# Altium project PCB_Project.PrjPcb
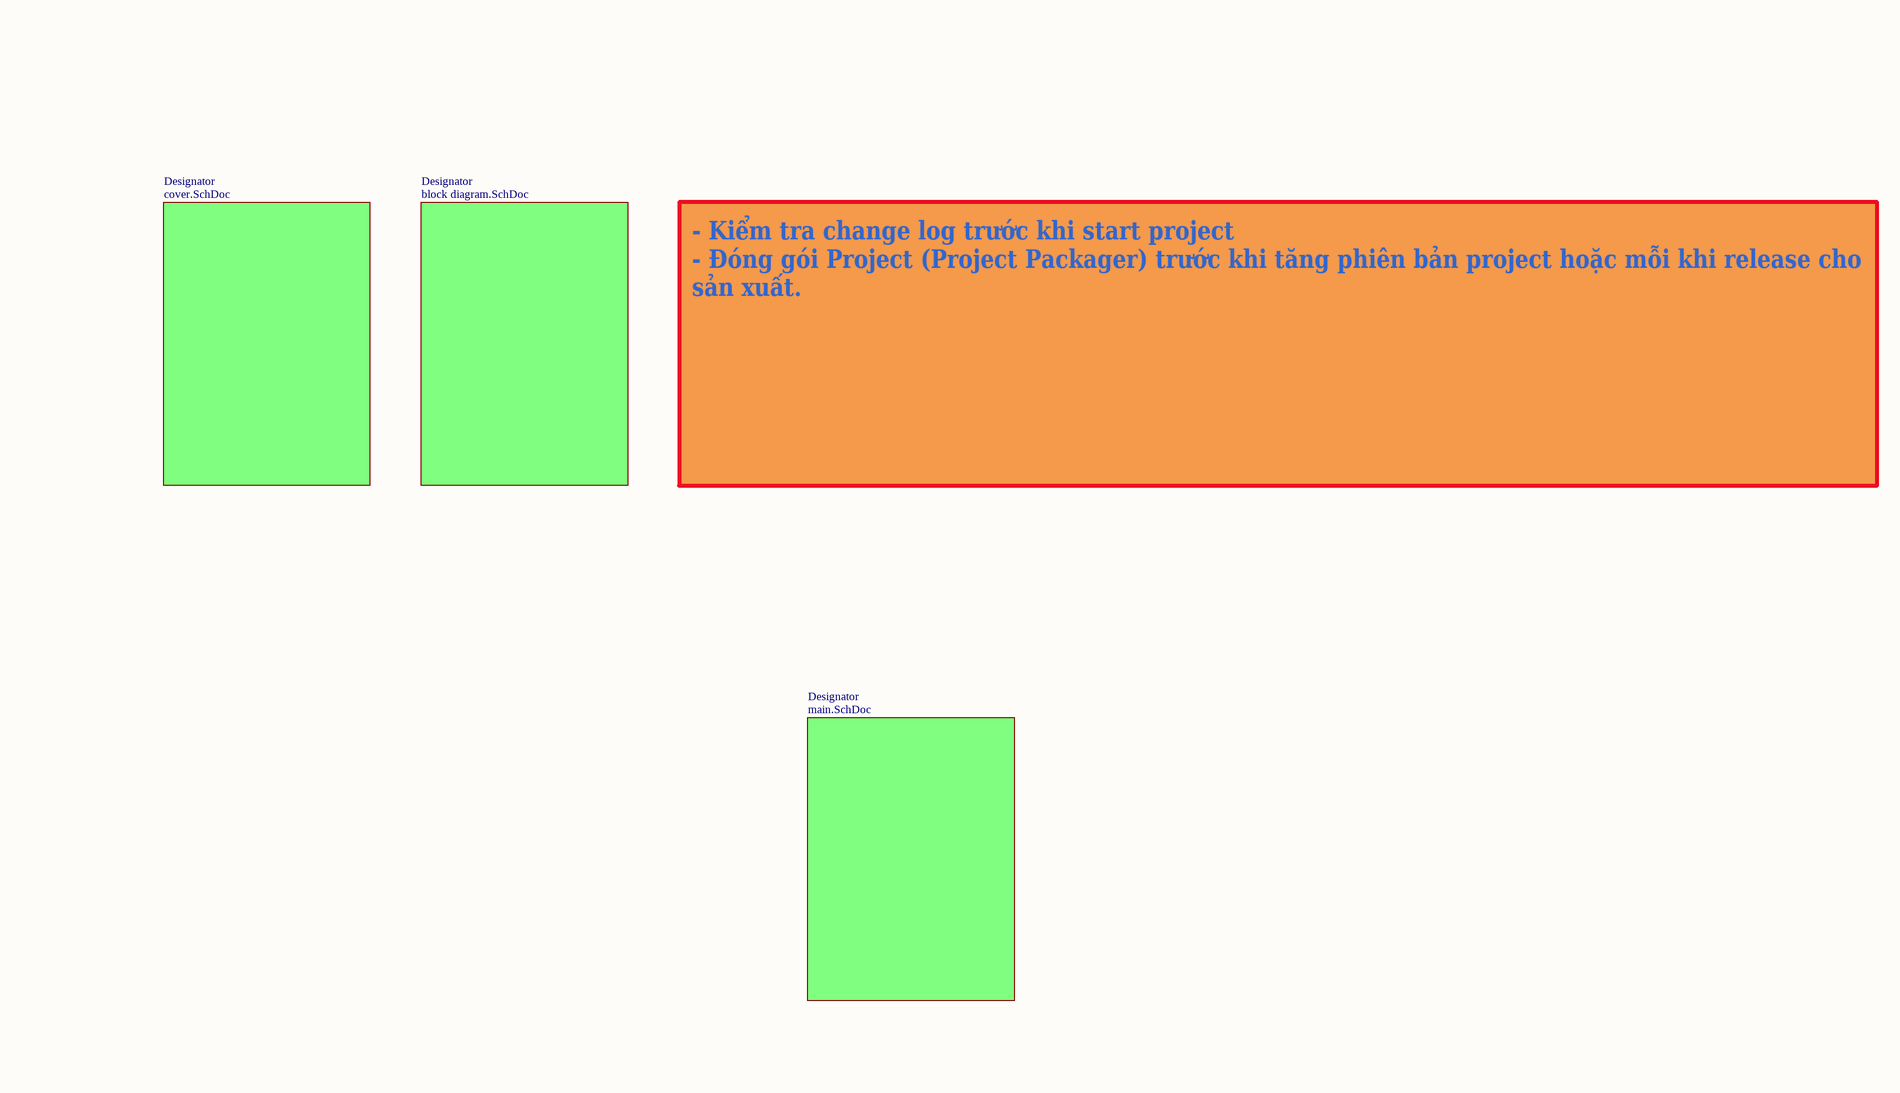
[diagram p0: root.SchDoc, left]
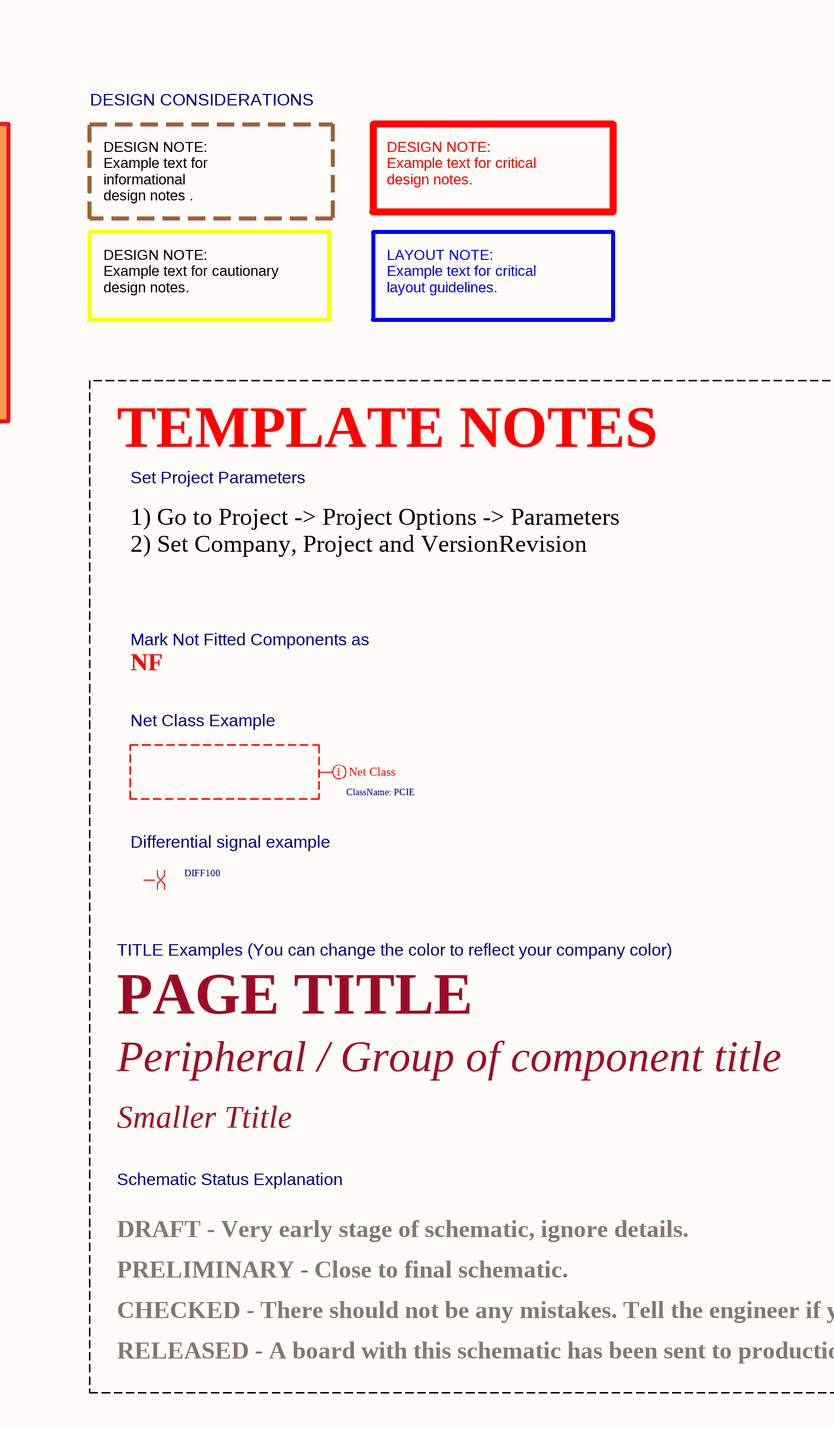
[diagram p1: root.SchDoc, right]
VersionRevision: v1.0A
4 sheets, 71 parts. Net scope: hierarchical (ports join the sheet entries above them; power ports are global).
Board file: prjname_A00.PcbDoc
Sheets:
  root.SchDoc
    Designator = block diagram.SchDoc
      U_FM_Module = FM_Module.SchDoc
      U_MCU_FM = MCU_FM.SchDoc

## Sheet root.SchDoc: PROJECT DIAGRAM
size A2; ApprovedBy: ---; CheckedBy: ---; CompanyName: BINHANH ELECTRONICS; DrawnBy: BienNB; DocumentNumber: 1; Revision: V1.0; SheetNumber: 1; SheetTotal: 11; PageSetup: Record=PageOptions|CenterHorizontal=True|CenterVertical=True|PrintScale=1.07|XCorrection=1.00|YCorrection=1.00|PrintKind=1|BorderSize=5000000|LeftOffset=0|BottomOffset=0|Orientation=2|PaperLength=1000|PaperWidth=1000|Scale=100|PaperSource=7|PrintQuality=600|MediaType=1|DitherType=10|PaperKind=A3|PrintScaleMode=1; Stage: DRAFT

### Sub-sheets
Designator = cover.SchDoc (file not in this document): no entries
Designator = block diagram.SchDoc: no entries
Designator = main.SchDoc (file not in this document): no entries

### Layout directives
net class PCIE: (no net found under the mark)
differential pair; net class DIFF100: (no net found under the mark)

### Notes on the sheet
- DESIGN CONSIDERATIONS
- DESIGN NOTE:
  Example text for informational
  design notes .
- DESIGN NOTE:
  Example text for critical
  design notes.
- DESIGN NOTE:
  Example text for cautionary
  design notes.
- LAYOUT NOTE:
  Example text for critical
  layout guidelines.
- - Kiểm tra change log trước khi start project
  - Đóng gói Project (Project Packager) trước khi tăng phiên bản project hoặc mỗi khi release cho sản xuất.
- TEMPLATE NOTES
- Set Project Parameters
- 1) Go to Project -> Project Options -> Parameters
  2) Set Company, Project and VersionRevision
- NF
- Mark Not Fitted Components as
- Net Class Example
- Differential signal example
- TITLE Examples (You can change the color to reflect your company color)
- PAGE TITLE
- Peripheral / Group of component title
- Smaller Ttitle
- Schematic Status Explanation
- PRELIMINARY - Close to final schematic.
- DRAFT - Very early stage of schematic, ignore details.
- RELEASED - A board with this schematic has been sent to production.
- CHECKED - There should not be any mistakes. Tell the engineer if you find one.
- Project:
- File:
- Size
- Rev
- A2
- Sheet
- /
- Drawn by:
- Checked by:
- Approved by:

## Sheet block diagram.SchDoc
size A3; DocumentNumber: 3; Revision: V1.0; SheetNumber: 3; SheetTotal: 11; Stage: DRAFT
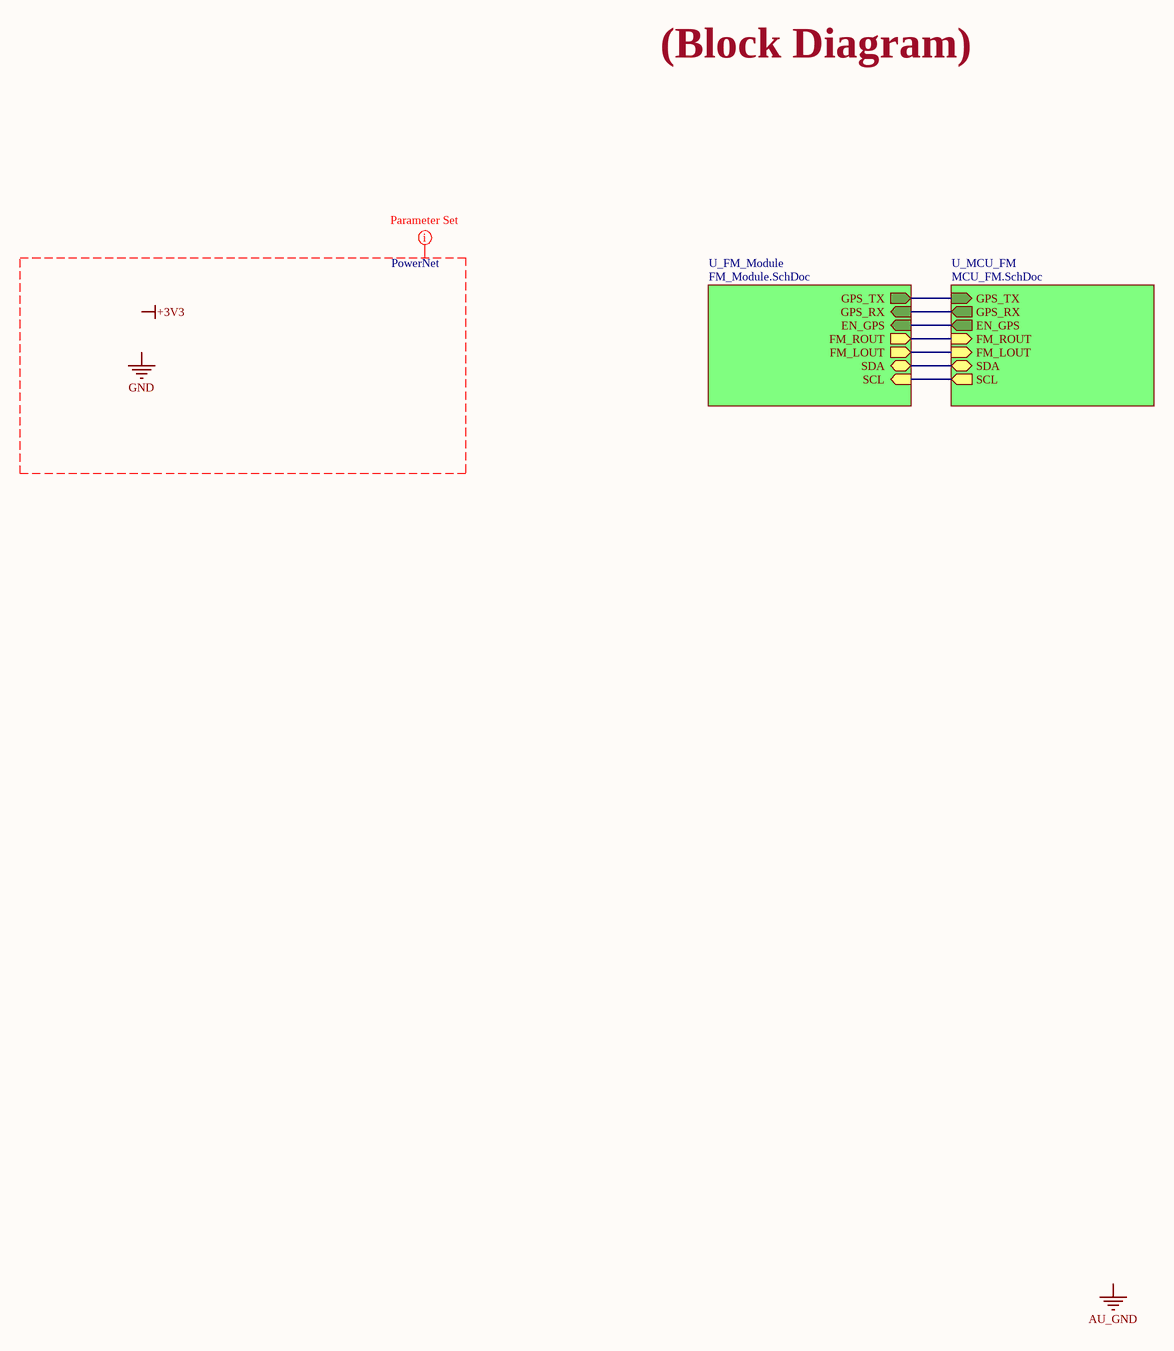
[diagram p2: block diagram.SchDoc]

### Sub-sheets
U_FM_Module = FM_Module.SchDoc: SCL (in), SDA (bidir), FM_LOUT (out), FM_ROUT (out), GPS_TX (out), GPS_RX (in), EN_GPS (in)
U_MCU_FM = MCU_FM.SchDoc: FM_LOUT (in), FM_ROUT (in), GPS_RX (out), SCL (out), SDA (bidir), GPS_TX (in), EN_GPS (out)

### Nets
I2C1_SCL: sheet U_FM_Module/SCL, sheet U_MCU_FM/SCL
I2C1_SDA: sheet U_FM_Module/SDA, sheet U_MCU_FM/SDA
UT1_RX: sheet U_FM_Module/GPS_TX, sheet U_MCU_FM/GPS_TX
UT1_TX: sheet U_FM_Module/GPS_RX, sheet U_MCU_FM/GPS_RX
NetC6_2: sheet U_FM_Module/FM_LOUT, sheet U_MCU_FM/FM_LOUT
NetC10_2: sheet U_FM_Module/FM_ROUT, sheet U_MCU_FM/FM_ROUT
NetR11_1: sheet U_FM_Module/EN_GPS, sheet U_MCU_FM/EN_GPS

### Layout directives
net class PowerNet: +3V3, GND

### Notes on the sheet
- (Block Diagram)
- CLOCKS (CPU & PCIE)
- Labels drawn without touching a wire or pin: +3V3, AU_GND, GND
- Project:
- File:
- Size
- Rev
- A3
- Sheet
- /
- Drawn by:
- Checked by:
- Approved by:

## Sheet FM_Module.SchDoc
size A4; Organization: Altium Limited; Address1: L3, 12a Rodborough Rd; Address2: Frenchs Forest; Address3: NSW; Address4: Australia 2086; Stage: DRAFT
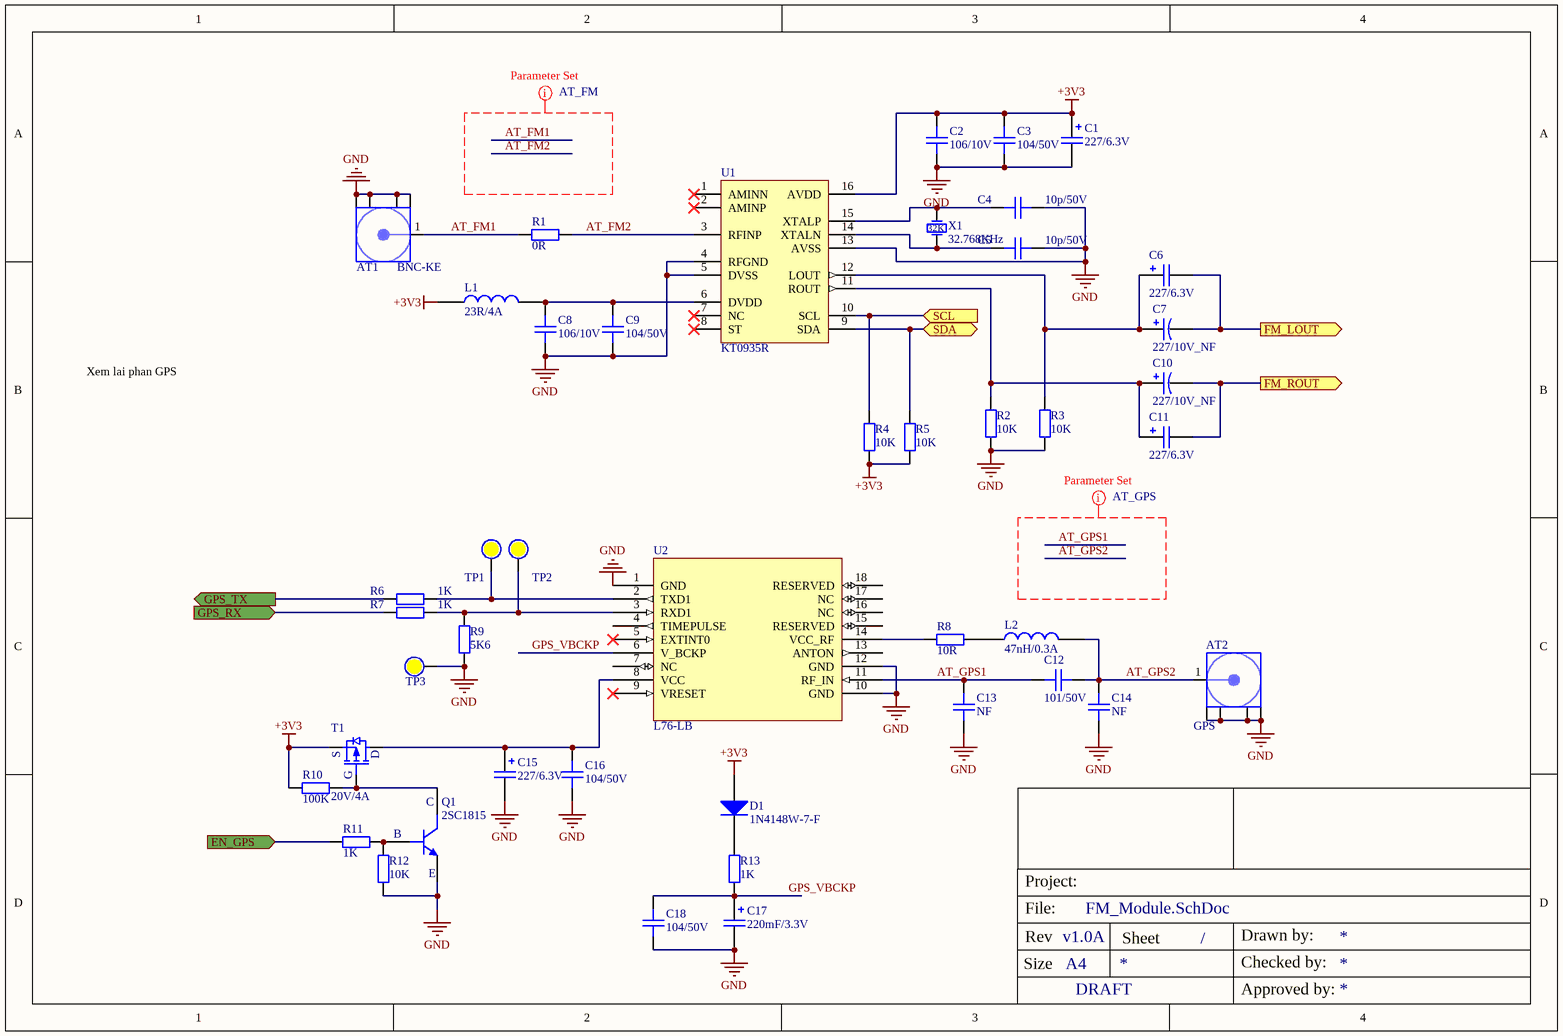
[diagram p3: FM_Module.SchDoc]

### Parts
AT1  BNC-KE  [BNC-KE]
AT2  GPS  [SMA-KE-20]
C1  227/6.3V  [CAP_TANTAL_1210(3528)]
C2  106/10V  [CAPC-0603 (1608) - HD]
C3  104/50V  [CAPC-0603 (1608) - HD]
C4  10p/50V  [CAPC-0603 (1608) - HD]
C5  10p/50V  [CAPC-0603 (1608) - HD]
C6  227/6.3V  [CAP_TANTAL_1210(3528)]
C7  227/10V_NF  [CAP_ALUM_D5.0_S2.0]
C8  106/10V  [CAPC-0603 (1608) - HD]
C9  104/50V  [CAPC-0603 (1608) - HD]
C10  227/10V_NF  [CAP_ALUM_D5.0_S2.0]
C11  227/6.3V  [CAP_TANTAL_1210(3528)]
C12  101/50V  [CAPC-0603 (1608) - HD]
C13  NF  [CAPC-0603 (1608) - HD]
C14  NF  [CAPC-0603 (1608) - HD]
C15  227/6.3V  [CAP_TANTAL_1210(3528)]
C16  104/50V  [CAPC-0603 (1608) - HD]
C17  220mF/3.3V  [CAP-SUPER-0.22F]
C18  104/50V  [CAPC-0603 (1608) - HD]
D1  1N4148W-7-F  [SOD-123]
L1  23R/4A  [IND-0603 (1608) - HD]
L2  47nH/0.3A  [IND-0603 (1608) - HD]
Q1  2SC1815  [SOT23_3]
R1  0R  [RESC-0603 (1608) - HD]
R2  10K  [RESC-0603 (1608) - HD]
R3  10K  [RESC-0603 (1608) - HD]
R4  10K  [RESC-0603 (1608) - HD]
R5  10K  [RESC-0603 (1608) - HD]
R6  1K  [RESC-0603 (1608) - HD]
R7  1K  [RESC-0603 (1608) - HD]
R8  10R  [RESC-0603 (1608) - HD]
R9  5K6  [RESC-0603 (1608) - HD]
R10  100K  [RESC-0603 (1608) - HD]
R11  1K  [RESC-0603 (1608) - HD]
R12  10K  [RESC-0603 (1608) - HD]
R13  1K  [RESC-0603 (1608) - HD]
T1  20V/4A  [SOT23_3]
TP1  (no value)  [Test Point 1 Side]  (no BOM)
TP2  (no value)  [Test Point 1 Side]  (no BOM)
TP3  (no value)  [Test Point 1 Side]  (no BOM)
U1  KT0935R  [KT0935R]
U2  L76-LB  [GPS.L7x]
X1  32.768KHz  [CRYSTAL_ABS06 2x1.2mm]

### Ports
EN_GPS (in), FM_LOUT (out), FM_ROUT (out), GPS_RX (in), GPS_TX (out), SCL (in), SDA (bidir)

### Nets
+3V3: C1.1 C2.2 C3.2 D1.1(A) L1.1 R4.1 R5.1 R10.1 T1.2(S) U1.16(AVDD)
GND: AT1.2 AT2.2 C1.2 C2.1 C3.1 C4.2 C5.2 C8.1 C9.1 C13.1 C14.1 C15.2 C16.1 C17.2 C18.1 Q1.2(E) R2.1 R3.1 R9.1 R12.1 TP3.0 U1.4(RFGND) U1.5(DVSS) U1.13(AVSS) U2.1(GND) U2.10(GND) U2.12(GND)
AT_FM1: AT1.1(Signal) R1.1
AT_FM2: R1.2 U1.3(RFINP)
AT_GPS1: C12.1 C13.2 U2.11(RF_IN)
AT_GPS2: AT2.1(Signal) C12.2 C14.2 L2.2
GPS_VBCKP: C17.1 C18.2 R13.1 U2.6(V_BCKP)
I2C1_SCL: R4.2 U1.10(SCL) ; port SCL
I2C1_SDA: R5.2 U1.9(SDA) ; port SDA
UT1_RX: R6.1 ; port GPS_TX
UT1_TX: R7.1 ; port GPS_RX
NetC4_1: C4.1 U1.15(XTALP) X1.1(OSC1)
NetC5_1: C5.1 U1.14(XTALN) X1.2(OSC2)
NetC6_1: C6.1 C7.1 R3.2 U1.12(LOUT)
NetC6_2: C6.2 C7.2 ; port FM_LOUT
NetC8_2: C8.2 C9.2 L1.2 U1.6(DVDD)
NetC10_1: C10.1 C11.1 R2.2 U1.11(ROUT)
NetC10_2: C10.2 C11.2 ; port FM_ROUT
NetC15_1: C15.1 C16.2 T1.3(D) U2.8(VCC)
NetD1_2: D1.2(K) R13.2
NetL2_1: L2.1 R8.2
NetQ1_1: Q1.1(B) R11.2 R12.2
NetQ1_3: Q1.3(C) R10.2 T1.1(G)
NetR6_2: R6.2 TP1.0 U2.2(TXD1)
NetR7_2: R7.2 R9.2 TP2.0 U2.3(RXD1)
NetR8_1: R8.1 U2.14(VCC_RF)
NetR11_1: R11.1 ; port EN_GPS

Not connected (* = marked no-connect by the designer): U1 1(AMINN)* 2(AMINP)* 7(NC)* 8(ST)*; U2 4(TIMEPULSE) 5(EXTINT0)* 7(NC) 9(VRESET)* 13(ANTON) 15(RESERVED) 16(NC) 17(NC) 18(RESERVED)

### Layout directives
net class AT_GPS: AT_GPS1, AT_GPS2
net class AT_FM: AT_FM1, AT_FM2

### Notes on the sheet
- Xem lai phan GPS
- Project:
- File:
- Size
- Rev
- A4
- Sheet
- /
- Drawn by:
- Checked by:
- Approved by:
- (in symbol ABS06-107-32.768kHz-T) 32K

### Library data of the parts
AT1 = BNC-KE: Solder: WAVE; MFR_URL: https://detail.tmall.com/item.htm?id=600889032311&ali_refid=a3_430620_1006:1106519694:N:bqURkf1/6XELXFWgHn0phw==:e744e300de7662eb842b86005d159f1e&ali_trackid=1_e744e300de7662eb842b86005d159f1e&spm=a230r.1.14.1&skuId=4376461827836; MPN: BNC-KE
AT2 = SMA-KE-15: Solder: WAVE; MPN: SMA-KE-20; Value: GPS
C1 C6 C11 C15 = T520B227M006ATE035: CAP TANT POLY 220uF 20% 6.3V 3528 35mOhm ESR; Solder: SMT; CompanyID: VT-00643; Value: 227/6.3V; MPN: T520B227M006ATE035; Category: CAPACITOR
C2 C8 = CL10A106KP8NNNC: CAP CER 10uF 10% 10V X5R 0603; CompanyID: VT-00984; Solder: SMT; MPN: CL10A106KP8NNNC; Value: 106/10V; Category: CAPACITOR; PinCount: 2
C3 C9 C16 C18 = C0603C104K5RACTU: CAP CER 0.1uF 50V 10% X7R 0603; CompanyID: VT-00982; Solder: SMT; MPN: C0603C104K5RACTU; Value: 104/50V; Category: CAPACITOR
  C3 C9 C16: PinCount: 2
C4 C5 = CL10C100JB8NNND: CAP CER 10pF 5% 50V NP0 0603; CompanyID: VT-00983; Solder: SMT; Value: 10p/50V; MPN: CL10C100JB8NNND; Category: CAPACITOR; PinCount: 2
C7 C10 = KM227M010D11RR0VH2FP0: 220uF 10V 5mm 11mm ±20% 2mm 1000hrs@105℃ Radial Leaded,5x11mm Aluminum Electrolytic Capacitors - Leaded ROHS; MFR: CX(Dongguan Chengxing Elec); SOLDER: WAVE; MPN: KM227M010D11RR0VH2FP0; CATEGORY: CAPPACITOR; Value: 227/10V_NF
C12 = GRM1885C1H101JA01D: CAP CER 100pF 5% 50V C0G/NP0 0603; Solder: SMT; Company ID: VT00091; MPN: GRM1885C1H101JA01D; Value: 101/50V
C13 C14 = CAPC NF 0603: CAP SMD, Not Fill, 0603; Solder: Not Fill; Value: NF; Category: CAPACITOR
C17 = DCK-3R3E224U-E: CAP 220mF SUPER -20% +80% 3.3V SMD; Solder: HAND; CompanyID: VT-00316; MPN: DCK-3R3E224U-E; value: 220mF/3.3V; Category: CAPACITOR
D1 = Diode 1N4148: Diode Standard 100V 300mA (DC) Surface Mount SOD-123; Brand: DIODES; Name: VT_DIODE_1N4148W-7-F; Part Number: 1N4148W-7-F
L1 = FBMJ1608HM230NT: IND-FERRITE BEAD 23 OHM  4A 0603 1LN; CompanyID: VT-01060; Solder: SMT; MPN: FBMJ1608HM230NT; Value: 23R/4A; Category: FERRITE BEAD; PinCount: 2
L2 = HK160847NJ-T: IND-FIXED 47nH 300mA 700 mOhm 0603; Solder: SMT; CompanyID: VT-01263; Value: 47nH/0.3A; MPN: HK160847NJ-T; Category: INDUCTOR
Q1 = 2SC1815: TRANS NPN 50V 0.15A SOT23-3; Solder: SMT; MPN: 2SC1815; Value: 2SC1815
R1 = RC0603FR-070RL: RES SMD 0.0OHM JUMPER 1/10W 0603; CompanyID: VT-00901; Solder: SMT; MPN: RC0603FR-070RL; Value: 0R; Category: RESISTOR
R2-R5 R12 = RC0603FR-0710KL: RES SMD 10K OHM 1% 1/10W 0603; CompanyID: VT-00328; Solder: SMT; MPN: RC0603FR-0710KL; Value: 10K; Category: RESISTOR
R6 R7 R11 R13 = RC0603FR-071KL: RES SMD 1 KOHM 1% 1/10W 0603; CompanyID: VT-00574; Solder: SMT; MPN: RC0603FR-071KL; Value: 1K; Category: RESISTOR
R8 = RC0603FR-0710RL: RES SMD 10 OHM 1% 1/10W 0603; CompanyID: VT-00865; Solder: SMT; MPN: RC0603FR-0710RL; Value: 10R; Category: RESISTOR
R9 = RC0603FR-075K6L: RES SMD 5.6K OHM 1% 1/10W 0603; CompanyID: VT-00869; Solder: SMT; MPN: RC0603FR-075K6L; Value: 5K6; Category: RESISTOR
R10 = RC0603FR-07100KL: RES SMD 100K OHM 1% 1/10W 0603; CompanyID: VT-00332; Solder: SMT; MPN: RC0603FR-07100KL; Value: 100K; Category: RESISTOR
T1 = AO3415: MOSFET P-CH 20V 4A SOT23; MFR: Alpha & Omega Semiconductor Inc.; Solder: SMT; Value: 20V/4A; MPN: AO3415
TP1-TP3 = Test Point: Solder: NF
U1 = KT0935R: RF RX AM/FM RECEIVER; Solder: SMT; Value: KT0935R; MPN: KT0935R; Category: IC
U2 = Quectel L76-LB: GPS Module L76-LB, Quectel; Solder: SMT; Value: L76-LB; MPN: L76-LB; MFR: Quectel; Category: MODULE; PinCount: 18
X1 = ABS06-107-32.768kHz-T: CRYSTAL 32.7680KHZ 4pF SMD; Solder: SMT; Company ID: VT00159; Value: 32.768KHz; MPN: ABS06-107-32.768kHz-T

## Sheet MCU_FM.SchDoc
size A4; Organization: Altium Limited; Address1: L3, 12a Rodborough Rd; Address2: Frenchs Forest; Address3: NSW; Address4: Australia 2086; Stage: DRAFT
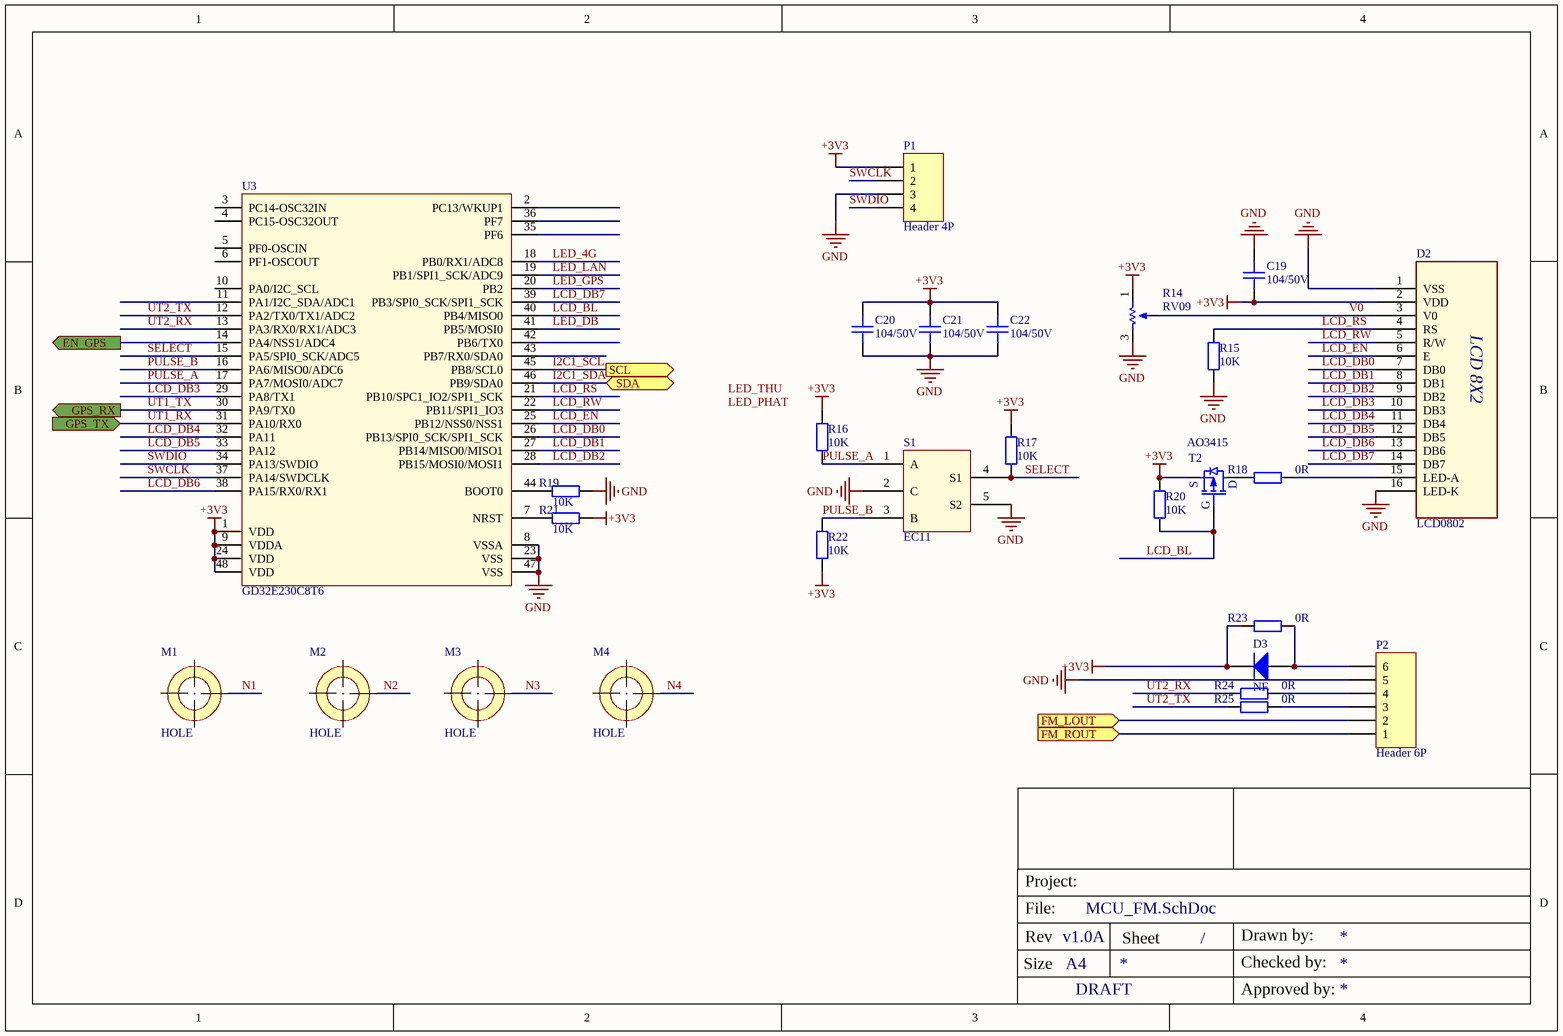
[diagram p4: MCU_FM.SchDoc]

### Parts
C19  104/50V  [CAPC-0603 (1608) - HD]
C20  104/50V  [CAPC-0603 (1608) - HD]
C21  104/50V  [CAPC-0603 (1608) - HD]
C22  104/50V  [CAPC-0603 (1608) - HD]
D2  LCD0802  [LCD 8X2 FORM 3]
D3  NF  [SOD-123]
M1  HOLE  [HOLE_3MM_6MM]  (no BOM)
M2  HOLE  [HOLE_3MM_6MM]  (no BOM)
M3  HOLE  [HOLE_3MM_6MM]  (no BOM)
M4  HOLE  [HOLE_3MM_6MM]  (no BOM)
P1  Header 4P  [HDR1X4 - W]
P2  Header 6P  [HDR1X6 - W]
R14  RV09  [RES_VAR_Type1]
R15  10K  [RESC-0603 (1608) - HD]
R16  10K  [RESC-0603 (1608) - HD]
R17  10K  [RESC-0603 (1608) - HD]
R18  0R  [RESC-0603 (1608) - HD]
R19  10K  [RESC-0603 (1608) - HD]
R20  10K  [RESC-0603 (1608) - HD]
R21  10K  [RESC-0603 (1608) - HD]
R22  10K  [RESC-0603 (1608) - HD]
R23  0R  [RESC-0603 (1608) - HD]
R24  0R  [RESC-0603 (1608) - HD]
R25  0R  [RESC-0603 (1608) - HD]
S1  EC11  [EC11]
T2  AO3415  [SOT23_3]
U3  GD32E230C8T6  [LQFP-48]

### Ports
EN_GPS (out), FM_LOUT (in), FM_ROUT (in), GPS_RX (out), GPS_TX (in), SCL (out), SDA (bidir)

### Nets
+3V3: C19.2 C20.2 C21.2 C22.2 D2.2(VDD) D3.2(K) P1.1 R14.1 R16.2 R17.2 R20.2 R21.2 R22.2 R23.1 T2.2(S) U3.1(VDD) U3.9(VDDA) U3.24(VDD) U3.48(VDD)
GND: C19.1 C20.1 C21.1 C22.1 D2.1(VSS) D2.16(LED-K) P1.3 P2.5 R14.3 R15.1 R19.2 S1.2(C) S1.5(S2) U3.8(VSSA) U3.23(VSS) U3.47(VSS)
I2C1_SCL: U3.45(PB8/SCL0) ; port SCL
I2C1_SDA: U3.46(PB9/SDA0) ; port SDA
LCD_BL: R20.1 T2.1(G) U3.40(PB4/MISO0)
LCD_DB0: D2.7(DB0) U3.26(PB13/SPI0_SCK/SPI1_SCK)
LCD_DB1: D2.8(DB1) U3.27(PB14/MISO0/MISO1)
LCD_DB2: D2.9(DB2) U3.28(PB15/MOSI0/MOSI1)
LCD_DB3: D2.10(DB3) U3.29(PA8/TX1)
LCD_DB4: D2.11(DB4) U3.32(PA11)
LCD_DB5: D2.12(DB5) U3.33(PA12)
LCD_DB6: D2.13(DB6) U3.38(PA15/RX0/RX1)
LCD_DB7: D2.14(DB7) U3.39(PB3/SPI0_SCK/SPI1_SCK)
LCD_EN: D2.6(E) U3.25(PB12/NSS0/NSS1)
LCD_RS: D2.4(RS) R15.2 U3.21(PB10/SPC1_IO2/SPI1_SCK)
LCD_RW: D2.5(R/W) U3.22(PB11/SPI1_IO3)
LED_4G: U3.18(PB0/RX1/ADC8)
LED_DB: U3.41(PB5/MOSI0)
LED_GPS: U3.20(PB2)
LED_LAN: U3.19(PB1/SPI1_SCK/ADC9)
PULSE_A: R16.1 S1.1(A) U3.17(PA7/MOSI0/ADC7)
PULSE_B: R22.1 S1.3(B) U3.16(PA6/MISO0/ADC6)
SELECT: R17.1 S1.4(S1) U3.15(PA5/SPI0_SCK/ADC5)
SWCLK: P1.2 U3.37(PA14/SWDCLK)
SWDIO: P1.4 U3.34(PA13/SWDIO)
UT1_RX: U3.31(PA10/RX0) ; port GPS_TX
UT1_TX: U3.30(PA9/TX0) ; port GPS_RX
UT2_RX: R24.1 U3.13(PA3/RX0/RX1/ADC3)
UT2_TX: R25.1 U3.12(PA2/TX0/TX1/ADC2)
V0: D2.3(V0) R14.2
NetC6_2: P2.2 ; port FM_LOUT
NetC10_2: P2.1 ; port FM_ROUT
NetD2_15: D2.15(LED-A) R18.2
NetD3_1: D3.1(A) P2.6 R23.2
NetP2_3: P2.3 R25.2
NetP2_4: P2.4 R24.2
NetR11_1: U3.14(PA4/NSS1/ADC4) ; port EN_GPS
NetR18_1: R18.1 T2.3(D)
NetR19_1: R19.1 U3.44(BOOT0)
NetR21_1: R21.1 U3.7(NRST)

Not connected (* = marked no-connect by the designer): U3 2(PC13/WKUP1) 3(PC14-OSC32IN) 4(PC15-OSC32OUT) 5(PF0-OSCIN) 6(PF1-OSCOUT) 10(PA0/I2C_SCL) 11(PA1/I2C_SDA/ADC1) 35(PF6) 36(PF7) 42(PB6/TX0) 43(PB7/RX0/SDA0)

### Notes on the sheet
- Labels drawn without touching a wire or pin: LED_PHAT, LED_THU
- Project:
- File:
- Size
- Rev
- A4
- Sheet
- /
- Drawn by:
- Checked by:
- Approved by:
- (in symbol LCD0802) LCD 8X2

### Library data of the parts
C19-C22 = C0603C104K5RACTU: as C3 on sheet FM_Module; MPN: C0603C104K5RACTU; Value: 104/50V; Category: CAPACITOR; PinCount: 2
D2 = LCD0802: MFR: China; Solder: Wave; MPN: LCD0802; Company ID: *; Value: LCD0802
D3 = Diode 1N4148: Diode Standard 100V 300mA (DC) Surface Mount SOD-123; Part Number: 1N4148W-7-F; Brand: DIODES; Name: VT_DIODE_1N4148W-7-F
M1-M4 = HOLE_3_5: 3mm/5mm; MPN: None; Solder: Not Fill; CompanyID: VT-; ClassName: MECH_HOLE; Value: HOLE
P1 = Header 4x1: Header, 4 Pin Pitch 2.54mm; MPN: S1012EC-40-ND; Company ID: VT-00125; Solder: WAVE; Value: Header 4P
P2 = Header 6x1: Header, 6 Pin Pitch 2.54mm; MPN: S1012EC-40-ND; CompanyID: VT-00125; Solder: WAVE; Value: Header 6P
R14 = Res Var RV09: Variable Resistor 10K; CMT: 10K
R15-R17 R19-R22 = RC0603FR-0710KL: RES SMD 10K OHM 1% 1/10W 0603; Solder: SMT; Company ID: VT00426; MPN: RC0603FR-0710KL; Value: 10K
R18 R23-R25 = RC0603FR-070RL: as R1 on sheet FM_Module; MPN: RC0603FR-070RL; Value: 0R; Category: RESISTOR
S1 = EC11: ENCODER SW EC11 - 20mm; MFR: China; MPN: EC11; URL: https://item.taobao.com/item.htm?spm=a230r.1.14.103.731253f74YATTg&id=579433658537&ns=1&abbucket=4#detail; Company ID: *; Value: EC11
T2 = AO3415: MOSFET P-CH 20V 4A SOT23; MFR: Alpha & Omega Semiconductor Inc.; Value: 20V/4A; Solder: SMT; MPN: AO3415
U3 = GD32E230C8T6: ARM® Cortex®-M23 32-bit MCU 64K Flash 8K RAM; MFR: Gigadevice; MPN: GD32E230C8T6; Value: GD32E230C8T6; Solder: LQFP-48; Category: IC; Company ID: *

## Nets that join several sheets
+3V3: FM_Module (10 pins), MCU_FM (19 pins)
GND: FM_Module (27 pins), MCU_FM (16 pins)
I2C1_SCL: FM_Module (R4.2 U1.10), MCU_FM (U3.45)
I2C1_SDA: FM_Module (R5.2 U1.9), MCU_FM (U3.46)
NetC6_2: FM_Module (C6.2 C7.2), MCU_FM (P2.2)
NetC10_2: FM_Module (C10.2 C11.2), MCU_FM (P2.1)
NetR11_1: FM_Module (R11.1), MCU_FM (U3.14)
UT1_RX: FM_Module (R6.1), MCU_FM (U3.31)
UT1_TX: FM_Module (R7.1), MCU_FM (U3.30)